# Altium schematic sheet 1XGSH00_KEY_LED.SchDoc
size A4
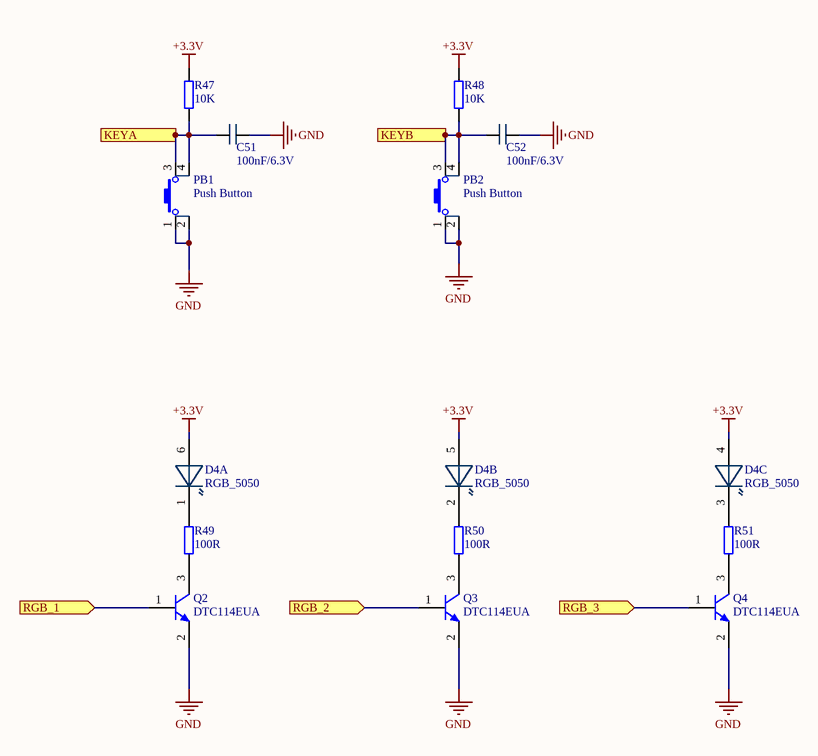
[diagram p0: 1XGSH00_KEY_LED.SchDoc]

## Parts
C51  100nF/6.3V  [0402_C]
C52  100nF/6.3V  [0402_C]
D4  RGB_5050  [LED_5050]  (parts A,B,C of 3)
PB1  Push Button  [SW-SMD_4P-L5.2-W5.2-P3.70-LS6.4]
PB2  Push Button  [SW-SMD_4P-L5.2-W5.2-P3.70-LS6.4]
Q2  DTC114EUA  [SC-70(SC-70-3)]
Q3  DTC114EUA  [SC-70(SC-70-3)]
Q4  DTC114EUA  [SC-70(SC-70-3)]
R47  10K  [0402_R]
R48  10K  [0402_R]
R49  100R  [0402_R]
R50  100R  [0402_R]
R51  100R  [0402_R]

## Ports
KEYA (out), KEYB (out), RGB_1 (in), RGB_2 (in), RGB_3 (in)

## Nets
+3.3V: D4.4(A3) D4.5(A2) D4.6(A1) R47.1 R48.1
GND: C51.1(-) C52.1(-) PB1.1 PB1.2 PB2.1 PB2.2 Q2.2(E) Q3.2(E) Q4.2(E)
KEYA: C51.2(-) PB1.3 PB1.4 R47.2 ; port KEYA
KEYB: C52.2(-) PB2.3 PB2.4 R48.2 ; port KEYB
RGB_1: Q2.1(B) ; port RGB_1
RGB_2: Q3.1(B) ; port RGB_2
RGB_3: Q4.1(B) ; port RGB_3
NetD4_1: D4.1(K1) R49.1
NetD4_2: D4.2(K2) R50.1
NetD4_3: D4.3(K3) R51.1
NetQ2_3: Q2.3(C) R49.2
NetQ3_3: Q3.3(C) R50.2
NetQ4_3: Q4.3(C) R51.2

## Library data of the parts
C51 C52 = Capacitor
D4 = RGB_5050: 5050 RGB LED
PB1 PB2 = SW-PB-SPST
Q2-Q4 = MMBT3904: NPN Bipolar Transistor; Published: 8-Jun-2000; LatestRevisionDate: 17-Jul-2002; LatestRevisionNote: Re-released for DXP Platform.; PackageReference: TO-226-AA; Publisher: Altium Limited; PackageDescription: TO, Flat Index; 3 In-Line, Axial Leads; Body Dia. 4.8mm; Leads 0.55 x 0.51 mm (max); Code_JEDEC: TO-226-AA
R47-R51 = Resistor: Value: 1K